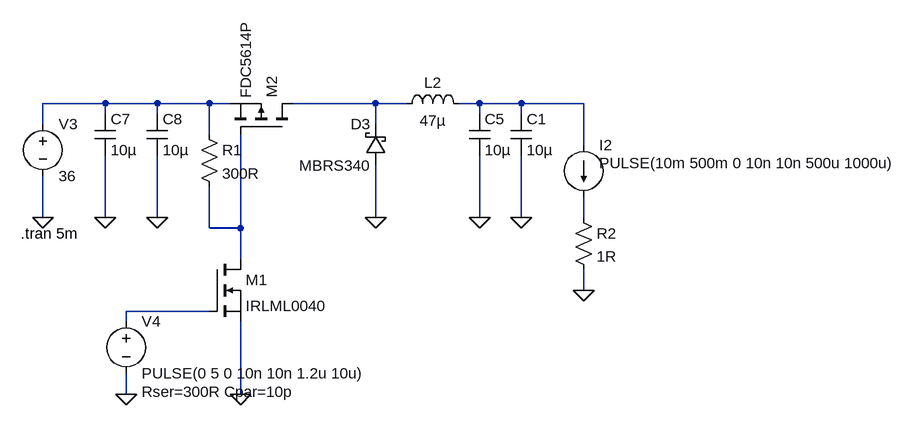
[diagram p0: schematic stepdown.asc]
stepdown.asc, the LTspice schematic file:
Version 4
SHEET 1 1240 680
WIRE 16 -224 -80 -224
WIRE 96 -224 16 -224
WIRE 176 -224 96 -224
WIRE 208 -224 176 -224
WIRE 432 -224 304 -224
WIRE 480 -224 432 -224
WIRE 592 -224 560 -224
WIRE 656 -224 592 -224
WIRE 752 -224 656 -224
WIRE 16 -208 16 -224
WIRE 96 -208 96 -224
WIRE 592 -208 592 -224
WIRE 656 -208 656 -224
WIRE -80 -192 -80 -224
WIRE 432 -192 432 -224
WIRE 176 -176 176 -224
WIRE 752 -160 752 -224
WIRE -80 -48 -80 -112
WIRE 16 -48 16 -144
WIRE 96 -48 96 -144
WIRE 432 -48 432 -128
WIRE 592 -48 592 -144
WIRE 656 -48 656 -144
WIRE 752 -48 752 -80
WIRE 176 -32 176 -96
WIRE 224 -32 224 -176
WIRE 224 -32 176 -32
WIRE 224 16 224 -32
WIRE 752 64 752 32
WIRE 176 96 48 96
WIRE 48 112 48 96
WIRE 48 224 48 192
WIRE 224 224 224 112
FLAG 752 64 0
FLAG 592 -48 0
FLAG 432 -48 0
FLAG 96 -48 0
FLAG 16 -48 0
FLAG -80 -48 0
FLAG 48 224 0
FLAG 656 -48 0
FLAG 224 224 0
SYMBOL pmos 304 -176 M270
SYMATTR InstName M2
SYMATTR Value FDC5614P
SYMBOL schottky 448 -128 R180
WINDOW 0 24 64 Left 2
WINDOW 3 24 0 Left 2
SYMATTR InstName D3
SYMATTR Value MBRS340
SYMATTR Description Diode
SYMATTR Type diode
SYMBOL ind 576 -208 M270
WINDOW 0 32 56 VTop 2
WINDOW 3 5 56 VBottom 2
SYMATTR InstName L2
SYMATTR Value 47µ
SYMBOL cap 576 -208 R0
SYMATTR InstName C5
SYMATTR Value 10µ
SYMBOL current 752 -160 R0
WINDOW 3 24 28 Left 2
WINDOW 123 0 0 Left 2
WINDOW 39 0 0 Left 2
SYMATTR InstName I2
SYMATTR Value PULSE(10m 500m 0 10n 10n 500u 1000u)
SYMBOL voltage -80 -208 R0
WINDOW 123 0 0 Left 2
WINDOW 39 0 0 Left 2
SYMATTR InstName V3
SYMATTR Value 36
SYMBOL cap 0 -208 R0
SYMATTR InstName C7
SYMATTR Value 10µ
SYMBOL cap 80 -208 R0
SYMATTR InstName C8
SYMATTR Value 10µ
SYMBOL voltage 48 96 R0
WINDOW 123 0 0 Left 2
WINDOW 39 24 124 Left 2
SYMATTR InstName V4
SYMATTR Value PULSE(0 5 0 10n 10n 1.2u 10u)
SYMATTR SpiceLine Rser=300R Cpar=10p
SYMBOL cap 640 -208 R0
SYMATTR InstName C1
SYMATTR Value 10µ
SYMBOL nmos 176 16 R0
SYMATTR InstName M1
SYMATTR Value IRLML0040
SYMBOL res 160 -192 R0
SYMATTR InstName R1
SYMATTR Value 300R
SYMBOL res 736 -64 R0
SYMATTR InstName R2
SYMATTR Value 1R
TEXT -114 -24 Left 2 !.tran 5m

The netlist it stands for:
* stepdown.asc
M2 N002 N005 N001 N001 FDC5614P
D3 0 N002 MBRS340
L2 N003 N002 47µ
C5 N003 0 10µ
I2 N003 N004 PULSE(10m 500m 0 10n 10n 500u 1000u)
V3 N001 0 36
C7 N001 0 10µ
C8 N001 0 10µ
V4 N006 0 PULSE(0 5 0 10n 10n 1.2u 10u) Rser=300R Cpar=10p
C1 N003 0 10µ
M1 N005 N006 0 0 IRLML0040
R1 N001 N005 300R
R2 N004 0 1R
.model D D
.lib standard.dio
.model NMOS NMOS
.model PMOS PMOS
.lib standard.mos
.tran 5m
.backanno
.end